# Altium schematic sheet Booster_Main_Board.SchDoc: ='Booster v'+rev
size 420 x 297 mm; Author: G.K.; CompanyName: WUT; DrawnBy: G.K.; Organization: WUT ISE; Address1: Warsaw Univeristy of Technology; Address2: Nowowiejska 15/19; DocumentNumber: 2; SheetNumber: 2; SheetTotal: 6; EDA_Number: ARTIQ; Projet: Booster RF Power Amplifier; ModifiedBy: -; CreateDate: XX/XX/XXXX; CheckedDate: -; Title2: TOP; DivGrp: ISE; Designer: G.K.; ModifiedDate: -; ProjectName: Booster RF Power Amplifier
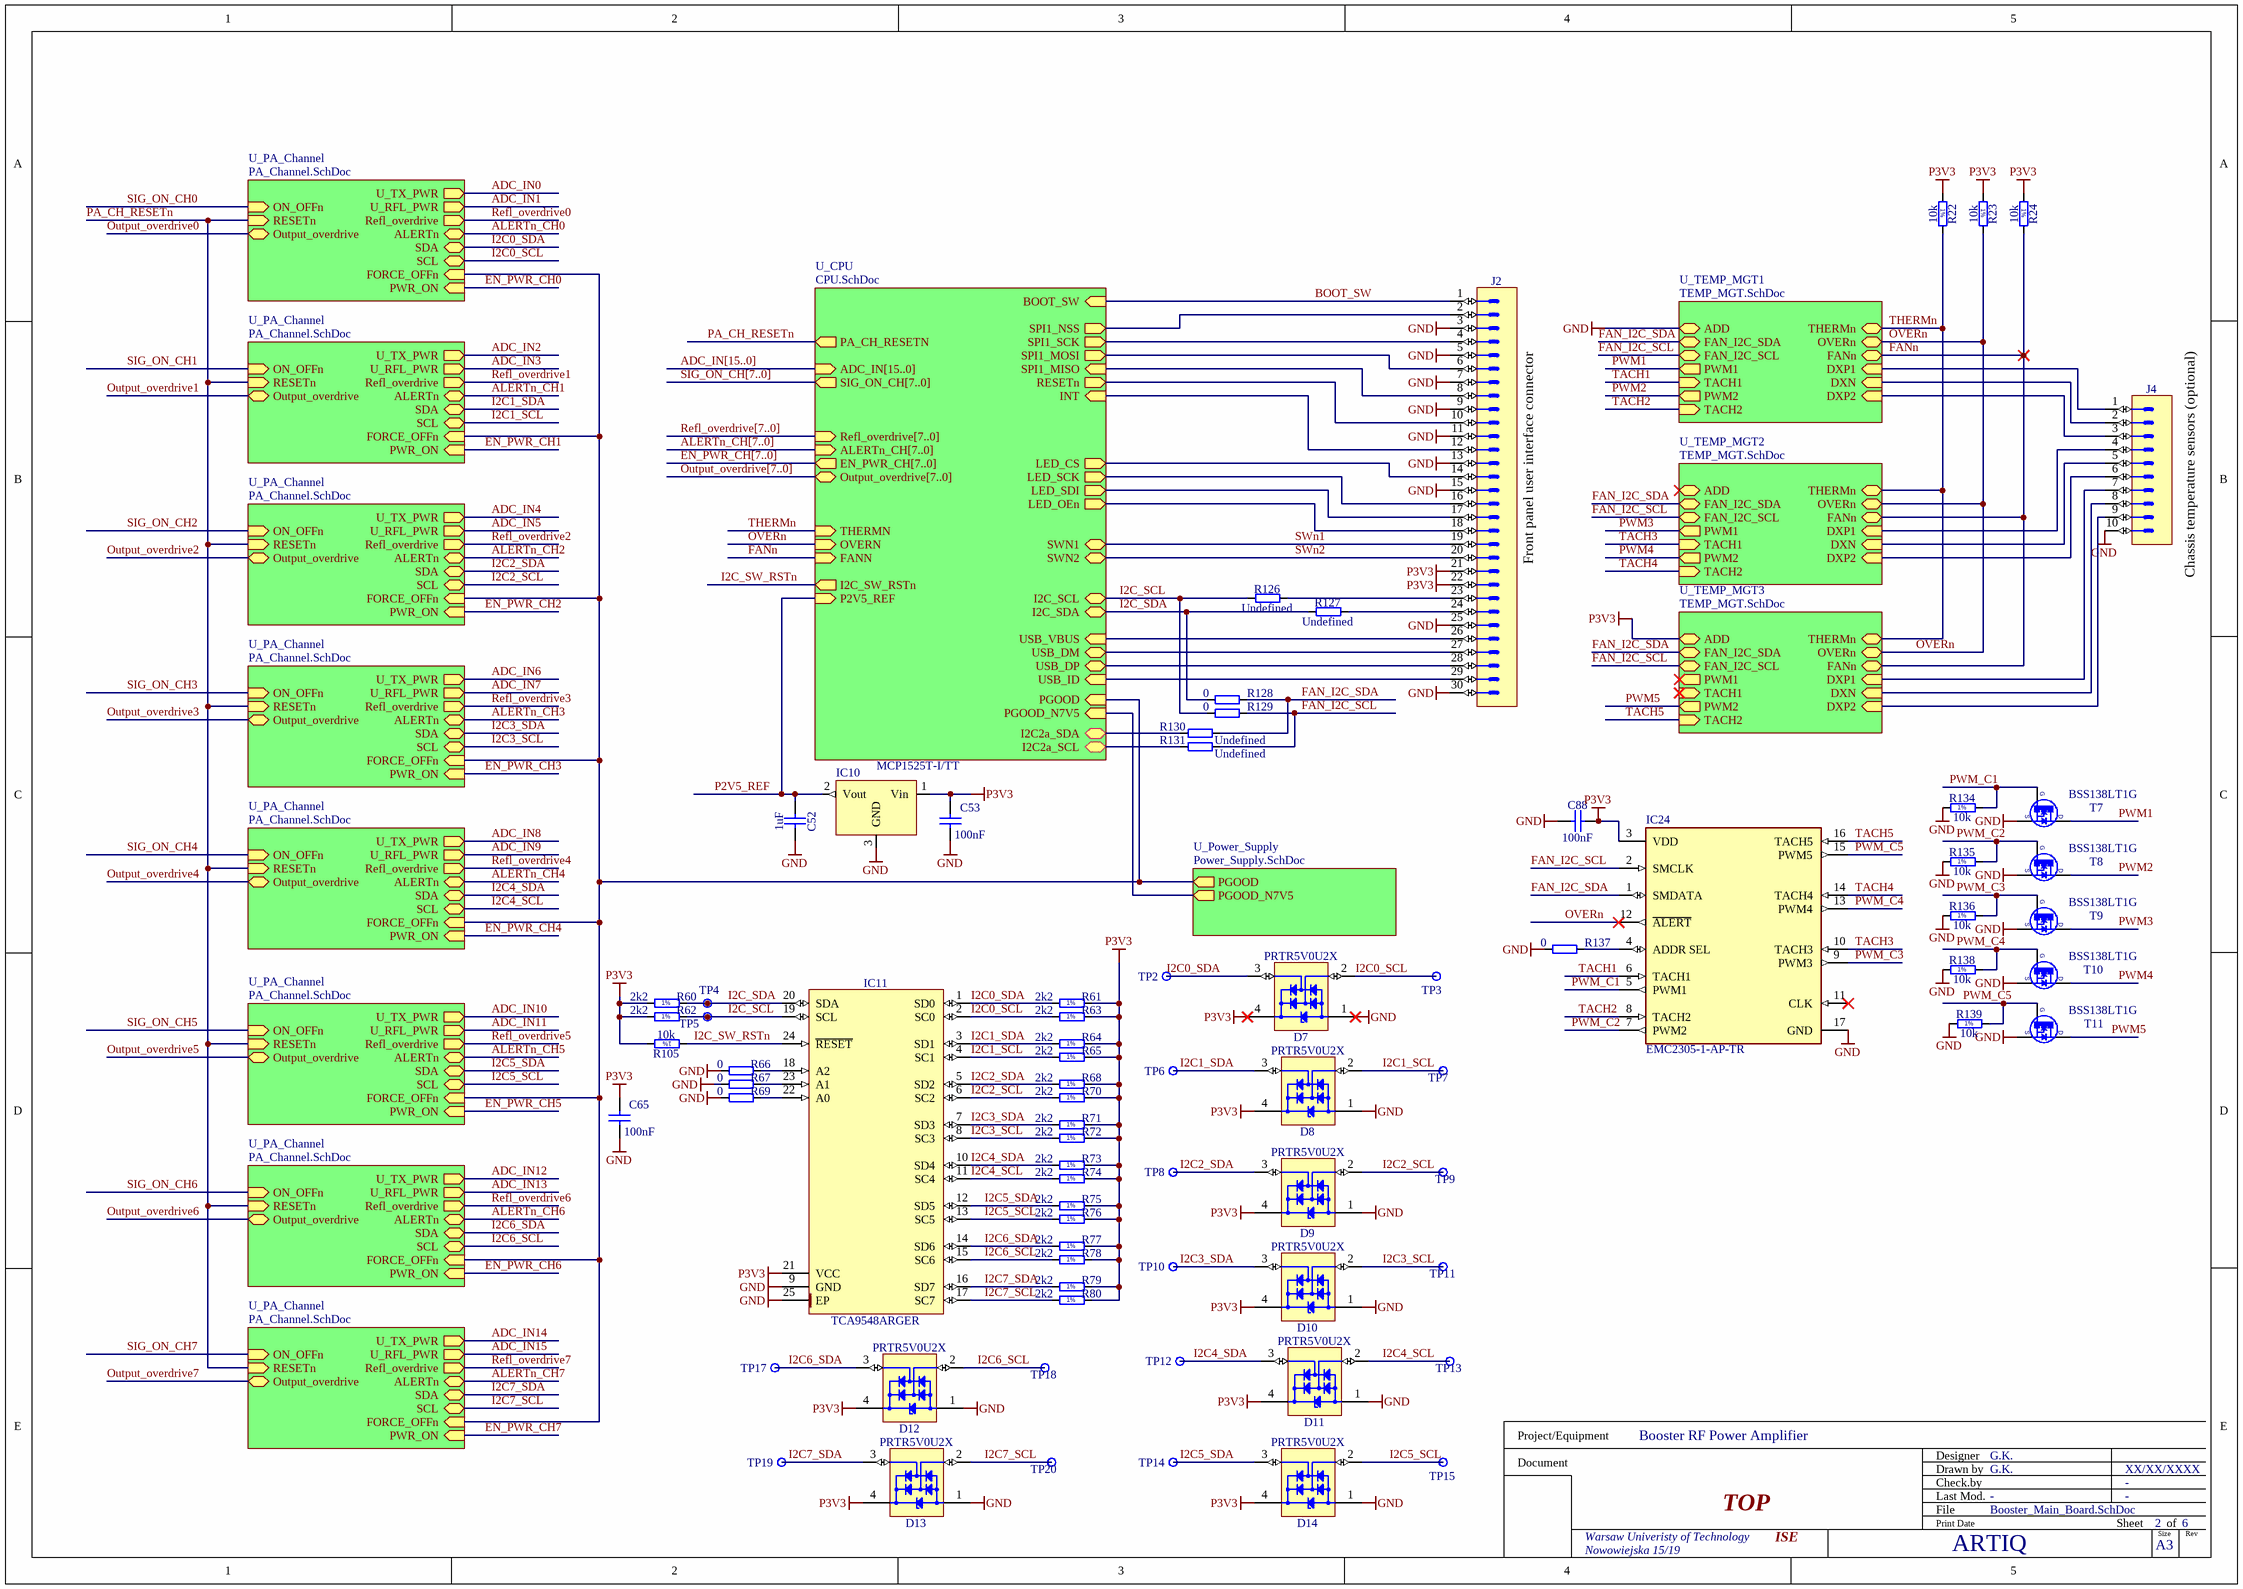
[diagram p0: Booster_Main_Board.SchDoc]

## Parts
C52  1uF  [CAPC1005X55N]
C53  100nF  [CAPC1005X55N]
C65  100nF  [CAPC1005X55N]
C88  100nF  [CAPC1005X55N]
D7  PRTR5V0U2X  [SOT190P230X110-4N]
D8  PRTR5V0U2X  [SOT190P230X110-4N]
D9  PRTR5V0U2X  [SOT190P230X110-4N]
D10  PRTR5V0U2X  [SOT190P230X110-4N]
D11  PRTR5V0U2X  [SOT190P230X110-4N]
D12  PRTR5V0U2X  [SOT190P230X110-4N]
D13  PRTR5V0U2X  [SOT190P230X110-4N]
D14  PRTR5V0U2X  [SOT190P230X110-4N]
IC10  MCP1525T-I/TT  [SOT95P251X112-3N]
IC11  TCA9548ARGER  [QFN50P400X400X100-25N-S220]
IC24  EMC2305-1-AP-TR  [FP-EMC2305-1-AP-TR-MFG]
J2  (no value)  [3M_N2530-6002RB]
J4  Header 10  [3M_N2510-6003RB]  (value not drawn)
R22  10k  [RESC1005X40N]
R23  10k  [RESC1005X40N]
R24  10k  [RESC1005X40N]
R60  2k2  [RESC1005X40N]
R61  2k2  [RESC1005X40N]
R62  2k2  [RESC1005X40N]
R63  2k2  [RESC1005X40N]
R64  2k2  [RESC1005X40N]
R65  2k2  [RESC1005X40N]
R66  0  [RESC1005X40N]
R67  0  [RESC1005X40N]
R68  2k2  [RESC1005X40N]
R69  0  [RESC1005X40N]
R70  2k2  [RESC1005X40N]
R71  2k2  [RESC1005X40N]
R72  2k2  [RESC1005X40N]
R73  2k2  [RESC1005X40N]
R74  2k2  [RESC1005X40N]
R75  2k2  [RESC1005X40N]
R76  2k2  [RESC1005X40N]
R77  2k2  [RESC1005X40N]
R78  2k2  [RESC1005X40N]
R79  2k2  [RESC1005X40N]
R80  2k2  [RESC1005X40N]
R105  10k  [RESC1005X40N]
R126  Undefined  [RESC1005X40N]
R127  Undefined  [RESC1005X40N]
R128  0  [RESC1005X40N]
R129  0  [RESC1005X40N]
R130  Undefined  [RESC1005X40N]
R131  Undefined  [RESC1005X40N]
R134  10k  [RESC1005X40N]
R135  10k  [RESC1005X40N]
R136  10k  [RESC1005X40N]
R137  0  [RESC1005X40N]
R138  10k  [RESC1005X40N]
R139  10k  [RESC1005X40N]
T7  BSS138LT1G  [SOT95P240X110-3N]
T8  BSS138LT1G  [SOT95P240X110-3N]
T9  BSS138LT1G  [SOT95P240X110-3N]
T10  BSS138LT1G  [SOT95P240X110-3N]
T11  BSS138LT1G  [SOT95P240X110-3N]
TP2  Test Point  [TPS127]  (value not drawn)
TP3  Test Point  [TPS127]  (value not drawn)
TP4  Test Point  [TPS127]  (value not drawn)
TP5  Test Point  [TPS127]  (value not drawn)
TP6  Test Point  [TPS127]  (value not drawn)
TP7  Test Point  [TPS127]  (value not drawn)
TP8  Test Point  [TPS127]  (value not drawn)
TP9  Test Point  [TPS127]  (value not drawn)
TP10  Test Point  [TPS127]  (value not drawn)
TP11  Test Point  [TPS127]  (value not drawn)
TP12  Test Point  [TPS127]  (value not drawn)
TP13  Test Point  [TPS127]  (value not drawn)
TP14  Test Point  [TPS127]  (value not drawn)
TP15  Test Point  [TPS127]  (value not drawn)
TP17  Test Point  [TPS127]  (value not drawn)
TP18  Test Point  [TPS127]  (value not drawn)
TP19  Test Point  [TPS127]  (value not drawn)
TP20  Test Point  [TPS127]  (value not drawn)

## Sub-sheets
U_CPU = CPU.SchDoc: ADC_IN[15..0] (in), SIG_ON_CH[7..0] (out), Refl_overdrive[7..0] (in), ALERTn_CH[7..0] (in), SPI1_NSS (out), SPI1_SCK (out), SPI1_MOSI (out), SPI1_MISO (in), RESETn (out), INT (in), LED_CS (out), LED_SCK (out), LED_SDI (out), LED_OEn (out), I2C_SCL (bidir), I2C_SDA (bidir), P2V5_REF (in), USB_DP (bidir), USB_ID (in), USB_DM (bidir), USB_VBUS (in), PA_CH_RESETN (out), PGOOD (in), EN_PWR_CH[7..0] (out), SWN1 (bidir), SWN2 (bidir), Output_overdrive[7..0] (bidir), THERMN (in), OVERN (in), FANN (in), PGOOD_N7V5 (in), BOOT_SW (in), I2C_SW_RSTn (out), I2C2a_SDA (bidir), I2C2a_SCL (bidir)
U_PA_Channel = PA_Channel.SchDoc: U_TX_PWR (out), U_RFL_PWR (out), SDA (bidir), SCL (bidir), ON_OFFn (in), Refl_overdrive (out), ALERTn (bidir), RESETn (in), PWR_ON (in), FORCE_OFFn (in), Output_overdrive (bidir)
U_PA_Channel = PA_Channel.SchDoc: U_TX_PWR (out), U_RFL_PWR (out), SDA (bidir), SCL (bidir), ON_OFFn (in), Refl_overdrive (out), ALERTn (bidir), RESETn (in), PWR_ON (in), FORCE_OFFn (in), Output_overdrive (bidir)
U_PA_Channel = PA_Channel.SchDoc: U_TX_PWR (out), U_RFL_PWR (out), SDA (bidir), SCL (bidir), ON_OFFn (in), Refl_overdrive (out), ALERTn (bidir), RESETn (in), PWR_ON (in), FORCE_OFFn (in), Output_overdrive (bidir)
U_PA_Channel = PA_Channel.SchDoc: U_TX_PWR (out), U_RFL_PWR (out), SDA (bidir), SCL (bidir), ON_OFFn (in), Refl_overdrive (out), ALERTn (bidir), RESETn (in), PWR_ON (in), FORCE_OFFn (in), Output_overdrive (bidir)
U_PA_Channel = PA_Channel.SchDoc: U_TX_PWR (out), U_RFL_PWR (out), SDA (bidir), SCL (bidir), ON_OFFn (in), Refl_overdrive (out), ALERTn (bidir), RESETn (in), PWR_ON (in), FORCE_OFFn (in), Output_overdrive (bidir)
U_PA_Channel = PA_Channel.SchDoc: U_TX_PWR (out), U_RFL_PWR (out), SDA (bidir), SCL (bidir), ON_OFFn (in), Refl_overdrive (out), ALERTn (bidir), RESETn (in), PWR_ON (in), FORCE_OFFn (in), Output_overdrive (bidir)
U_PA_Channel = PA_Channel.SchDoc: U_TX_PWR (out), U_RFL_PWR (out), SDA (bidir), SCL (bidir), ON_OFFn (in), Refl_overdrive (out), ALERTn (bidir), RESETn (in), PWR_ON (in), FORCE_OFFn (in), Output_overdrive (bidir)
U_PA_Channel = PA_Channel.SchDoc: U_TX_PWR (out), U_RFL_PWR (out), SDA (bidir), SCL (bidir), ON_OFFn (in), Refl_overdrive (out), ALERTn (bidir), RESETn (in), PWR_ON (in), FORCE_OFFn (in), Output_overdrive (bidir)
U_Power_Supply = Power_Supply.SchDoc: PGOOD (out), PGOOD_N7V5 (out)
U_TEMP_MGT1 = TEMP_MGT.SchDoc: ADD (bidir), THERMn (bidir), OVERn (bidir), FANn (bidir), FAN_I2C_SCL (bidir), FAN_I2C_SDA (bidir), DXP1 (in), DXN (in), DXP2 (in), PWM2 (out), TACH2 (in), TACH1 (in), PWM1 (out)
U_TEMP_MGT2 = TEMP_MGT.SchDoc: ADD (bidir), THERMn (bidir), OVERn (bidir), FANn (bidir), FAN_I2C_SCL (bidir), FAN_I2C_SDA (bidir), DXP1 (in), DXN (in), DXP2 (in), PWM2 (out), TACH2 (in), TACH1 (in), PWM1 (out)
U_TEMP_MGT3 = TEMP_MGT.SchDoc: ADD (bidir), THERMn (bidir), OVERn (bidir), FANn (bidir), FAN_I2C_SCL (bidir), FAN_I2C_SDA (bidir), DXP1 (in), DXN (in), DXP2 (in), PWM2 (out), TACH2 (in), TACH1 (in), PWM1 (out)

## Nets
GND: C52.2 C53.2 C65.2 C88.1 D7.1(GND) D8.1(GND) D9.1(GND) D10.1(GND) D11.1(GND) D12.1(GND) D13.1(GND) D14.1(GND) IC10.3(GND) IC11.9(GND) IC11.25(EP) IC24.17(GND) J2.3 J2.5 J2.7 J2.9 J2.11 J2.13 J2.15 J2.25 J2.30 J4.10 R66.1 R67.1 R69.1 R134.1 R135.1 R136.1 R137.1 R138.1 R139.1 T7.2(S) T8.2(S) T9.2(S) T10.2(S) T11.2(S) ; sheet U_TEMP_MGT1/ADD
P3V3: C53.1 C65.1 C88.2 D7.4(VCC) D8.4(VCC) D9.4(VCC) D10.4(VCC) D11.4(VCC) D12.4(VCC) D13.4(VCC) D14.4(VCC) IC10.1(Vin) IC11.21(VCC) IC24.3(VDD) J2.21 J2.22 R22.1 R23.1 R24.1 R60.1 R61.2 R62.1 R63.2 R64.2 R65.2 R68.2 R70.2 R71.2 R72.2 R73.2 R74.2 R75.2 R76.2 R77.2 R78.2 R79.2 R80.2 R105.2 ; sheet U_TEMP_MGT3/ADD
ADC_IN0: sheet U_PA_Channel/U_TX_PWR
ADC_IN1: sheet U_PA_Channel/U_RFL_PWR
ADC_IN2: sheet U_PA_Channel/U_TX_PWR
ADC_IN3: sheet U_PA_Channel/U_RFL_PWR
ADC_IN4: sheet U_PA_Channel/U_TX_PWR
ADC_IN5: sheet U_PA_Channel/U_RFL_PWR
ADC_IN6: sheet U_PA_Channel/U_TX_PWR
ADC_IN7: sheet U_PA_Channel/U_RFL_PWR
ADC_IN8: sheet U_PA_Channel/U_TX_PWR
ADC_IN9: sheet U_PA_Channel/U_RFL_PWR
ADC_IN10: sheet U_PA_Channel/U_TX_PWR
ADC_IN11: sheet U_PA_Channel/U_RFL_PWR
ADC_IN12: sheet U_PA_Channel/U_TX_PWR
ADC_IN13: sheet U_PA_Channel/U_RFL_PWR
ADC_IN14: sheet U_PA_Channel/U_TX_PWR
ADC_IN15: sheet U_PA_Channel/U_RFL_PWR
ALERTn_CH0: sheet U_PA_Channel/ALERTn
ALERTn_CH1: sheet U_PA_Channel/ALERTn
ALERTn_CH2: sheet U_PA_Channel/ALERTn
ALERTn_CH3: sheet U_PA_Channel/ALERTn
ALERTn_CH4: sheet U_PA_Channel/ALERTn
ALERTn_CH5: sheet U_PA_Channel/ALERTn
ALERTn_CH6: sheet U_PA_Channel/ALERTn
ALERTn_CH7: sheet U_PA_Channel/ALERTn
BOOT_SW: J2.1 ; sheet U_CPU/BOOT_SW
EN_PWR_CH0: sheet U_PA_Channel/PWR_ON
EN_PWR_CH1: sheet U_PA_Channel/PWR_ON
EN_PWR_CH2: sheet U_PA_Channel/PWR_ON
EN_PWR_CH3: sheet U_PA_Channel/PWR_ON
EN_PWR_CH4: sheet U_PA_Channel/PWR_ON
EN_PWR_CH5: sheet U_PA_Channel/PWR_ON
EN_PWR_CH6: sheet U_PA_Channel/PWR_ON
EN_PWR_CH7: sheet U_PA_Channel/PWR_ON
FAN_I2C_SCL: IC24.2(SMCLK) R129.2 R131.2 ; sheet U_TEMP_MGT1/FAN_I2C_SCL, sheet U_TEMP_MGT2/FAN_I2C_SCL, sheet U_TEMP_MGT3/FAN_I2C_SCL
FAN_I2C_SDA: IC24.1(SMDATA) R128.2 R130.2 ; sheet U_TEMP_MGT1/FAN_I2C_SDA, sheet U_TEMP_MGT2/FAN_I2C_SDA, sheet U_TEMP_MGT3/FAN_I2C_SDA
FANn: R24.2 ; sheet U_CPU/FANN, sheet U_TEMP_MGT1/FANn, sheet U_TEMP_MGT2/FANn, sheet U_TEMP_MGT3/FANn
I2C0_SCL: D7.2(I/O1) IC11.2(SC0) R63.1 TP3.1 ; sheet U_PA_Channel/SCL
I2C0_SDA: D7.3(I/O2) IC11.1(SD0) R61.1 TP2.1 ; sheet U_PA_Channel/SDA
I2C1_SCL: D8.2(I/O1) IC11.4(SC1) R65.1 TP7.1 ; sheet U_PA_Channel/SCL
I2C1_SDA: D8.3(I/O2) IC11.3(SD1) R64.1 TP6.1 ; sheet U_PA_Channel/SDA
I2C2_SCL: D9.2(I/O1) IC11.6(SC2) R70.1 TP9.1 ; sheet U_PA_Channel/SCL
I2C2_SDA: D9.3(I/O2) IC11.5(SD2) R68.1 TP8.1 ; sheet U_PA_Channel/SDA
I2C3_SCL: D10.2(I/O1) IC11.8(SC3) R72.1 TP11.1 ; sheet U_PA_Channel/SCL
I2C3_SDA: D10.3(I/O2) IC11.7(SD3) R71.1 TP10.1 ; sheet U_PA_Channel/SDA
I2C4_SCL: D11.2(I/O1) IC11.11(SC4) R74.1 TP13.1 ; sheet U_PA_Channel/SCL
I2C4_SDA: D11.3(I/O2) IC11.10(SD4) R73.1 TP12.1 ; sheet U_PA_Channel/SDA
I2C5_SCL: D14.2(I/O1) IC11.13(SC5) R76.1 TP15.1 ; sheet U_PA_Channel/SCL
I2C5_SDA: D14.3(I/O2) IC11.12(SD5) R75.1 TP14.1 ; sheet U_PA_Channel/SDA
I2C6_SCL: D12.2(I/O1) IC11.15(SC6) R78.1 TP18.1 ; sheet U_PA_Channel/SCL
I2C6_SDA: D12.3(I/O2) IC11.14(SD6) R77.1 TP17.1 ; sheet U_PA_Channel/SDA
I2C7_SCL: D13.2(I/O1) IC11.17(SC7) R80.1 TP20.1 ; sheet U_PA_Channel/SCL
I2C7_SDA: D13.3(I/O2) IC11.16(SD7) R79.1 TP19.1 ; sheet U_PA_Channel/SDA
I2C_SCL: IC11.19(SCL) R62.2 R126.1 R129.1 TP5.1 ; sheet U_CPU/I2C_SCL
I2C_SDA: IC11.20(SDA) R60.2 R127.1 R128.1 TP4.1 ; sheet U_CPU/I2C_SDA
I2C_SW_RSTn: IC11.24(~{RESET}) R105.1 ; sheet U_CPU/I2C_SW_RSTn
Output_overdrive0: sheet U_PA_Channel/Output_overdrive
Output_overdrive1: sheet U_PA_Channel/Output_overdrive
Output_overdrive2: sheet U_PA_Channel/Output_overdrive
Output_overdrive3: sheet U_PA_Channel/Output_overdrive
Output_overdrive4: sheet U_PA_Channel/Output_overdrive
Output_overdrive5: sheet U_PA_Channel/Output_overdrive
Output_overdrive6: sheet U_PA_Channel/Output_overdrive
Output_overdrive7: sheet U_PA_Channel/Output_overdrive
OVERn: IC24.12(~{ALERT}) R23.2 ; sheet U_CPU/OVERN, sheet U_TEMP_MGT1/OVERn, sheet U_TEMP_MGT2/OVERn, sheet U_TEMP_MGT3/OVERn
P2V5_REF: C52.1 IC10.2(Vout) ; sheet U_CPU/P2V5_REF
PA_CH_RESETn: sheet U_CPU/PA_CH_RESETN, sheet U_PA_Channel/RESETn, sheet U_PA_Channel/RESETn, sheet U_PA_Channel/RESETn, sheet U_PA_Channel/RESETn, sheet U_PA_Channel/RESETn, sheet U_PA_Channel/RESETn, sheet U_PA_Channel/RESETn, sheet U_PA_Channel/RESETn
PWM1: T7.3(D) ; sheet U_TEMP_MGT1/PWM1
PWM2: T8.3(D) ; sheet U_TEMP_MGT1/PWM2
PWM3: T9.3(D) ; sheet U_TEMP_MGT2/PWM1
PWM4: T10.3(D) ; sheet U_TEMP_MGT2/PWM2
PWM5: T11.3(D) ; sheet U_TEMP_MGT3/PWM2
PWM_C1: IC24.5(PWM1) R134.2 T7.1(G)
PWM_C2: IC24.7(PWM2) R135.2 T8.1(G)
PWM_C3: IC24.9(PWM3) R136.2 T9.1(G)
PWM_C4: IC24.13(PWM4) R138.2 T10.1(G)
PWM_C5: IC24.15(PWM5) R139.2 T11.1(G)
Refl_overdrive0: sheet U_PA_Channel/Refl_overdrive
Refl_overdrive1: sheet U_PA_Channel/Refl_overdrive
Refl_overdrive2: sheet U_PA_Channel/Refl_overdrive
Refl_overdrive3: sheet U_PA_Channel/Refl_overdrive
Refl_overdrive4: sheet U_PA_Channel/Refl_overdrive
Refl_overdrive5: sheet U_PA_Channel/Refl_overdrive
Refl_overdrive6: sheet U_PA_Channel/Refl_overdrive
Refl_overdrive7: sheet U_PA_Channel/Refl_overdrive
SIG_ON_CH0: sheet U_PA_Channel/ON_OFFn
SIG_ON_CH1: sheet U_PA_Channel/ON_OFFn
SIG_ON_CH2: sheet U_PA_Channel/ON_OFFn
SIG_ON_CH3: sheet U_PA_Channel/ON_OFFn
SIG_ON_CH4: sheet U_PA_Channel/ON_OFFn
SIG_ON_CH5: sheet U_PA_Channel/ON_OFFn
SIG_ON_CH6: sheet U_PA_Channel/ON_OFFn
SIG_ON_CH7: sheet U_PA_Channel/ON_OFFn
SWn1: J2.19 ; sheet U_CPU/SWN1
SWn2: J2.20 ; sheet U_CPU/SWN2
TACH1: IC24.6(TACH1) ; sheet U_TEMP_MGT1/TACH1
TACH2: IC24.8(TACH2) ; sheet U_TEMP_MGT1/TACH2
TACH3: IC24.10(TACH3) ; sheet U_TEMP_MGT2/TACH1
TACH4: IC24.14(TACH4) ; sheet U_TEMP_MGT2/TACH2
TACH5: IC24.16(TACH5) ; sheet U_TEMP_MGT3/TACH2
THERMn: R22.2 ; sheet U_CPU/THERMN, sheet U_TEMP_MGT1/THERMn, sheet U_TEMP_MGT2/THERMn, sheet U_TEMP_MGT3/THERMn
NetIC11_18: IC11.18(A2) R66.2
NetIC11_22: IC11.22(A0) R69.2
NetIC11_23: IC11.23(A1) R67.2
NetIC24_4: IC24.4(ADDR_SEL) R137.2
NetJ2_2: J2.2 ; sheet U_CPU/SPI1_NSS
NetJ2_4: J2.4 ; sheet U_CPU/SPI1_SCK
NetJ2_6: J2.6 ; sheet U_CPU/SPI1_MOSI
NetJ2_8: J2.8 ; sheet U_CPU/SPI1_MISO
NetJ2_10: J2.10 ; sheet U_CPU/RESETn
NetJ2_12: J2.12 ; sheet U_CPU/INT
NetJ2_14: J2.14 ; sheet U_CPU/LED_CS
NetJ2_16: J2.16 ; sheet U_CPU/LED_SCK
NetJ2_17: J2.17 ; sheet U_CPU/LED_SDI
NetJ2_18: J2.18 ; sheet U_CPU/LED_OEn
NetJ2_23: J2.23 R126.2
NetJ2_24: J2.24 R127.2
NetJ2_26: J2.26 ; sheet U_CPU/USB_VBUS
NetJ2_27: J2.27 ; sheet U_CPU/USB_DM
NetJ2_28: J2.28 ; sheet U_CPU/USB_DP
NetJ2_29: J2.29 ; sheet U_CPU/USB_ID
NetJ4_1: J4.1 ; sheet U_TEMP_MGT1/DXP1
NetJ4_2: J4.2 ; sheet U_TEMP_MGT1/DXN
NetJ4_3: J4.3 ; sheet U_TEMP_MGT1/DXP2
NetJ4_4: J4.4 ; sheet U_TEMP_MGT2/DXP1
NetJ4_5: J4.5 ; sheet U_TEMP_MGT2/DXN
NetJ4_6: J4.6 ; sheet U_TEMP_MGT2/DXP2
NetJ4_7: J4.7 ; sheet U_TEMP_MGT3/DXP1
NetJ4_8: J4.8 ; sheet U_TEMP_MGT3/DXN
NetJ4_9: J4.9 ; sheet U_TEMP_MGT3/DXP2
NetR130_1: R130.1 ; sheet U_CPU/I2C2a_SDA
NetR131_1: R131.1 ; sheet U_CPU/I2C2a_SCL
(unnamed): sheet U_CPU/PGOOD, sheet U_PA_Channel/FORCE_OFFn, sheet U_PA_Channel/FORCE_OFFn, sheet U_PA_Channel/FORCE_OFFn, sheet U_PA_Channel/FORCE_OFFn, sheet U_PA_Channel/FORCE_OFFn, sheet U_PA_Channel/FORCE_OFFn, sheet U_PA_Channel/FORCE_OFFn, sheet U_PA_Channel/FORCE_OFFn, sheet U_Power_Supply/PGOOD
(unnamed): sheet U_CPU/PGOOD_N7V5, sheet U_Power_Supply/PGOOD_N7V5

Not connected (* = marked no-connect by the designer): IC24 11(CLK)*

## Buses and harness runs
bus ADC_IN[15..0] = sheet U_CPU/ADC_IN[15..0]
bus ALERTn_CH[7..0] = sheet U_CPU/ALERTn_CH[7..0]
bus EN_PWR_CH[7..0] = sheet U_CPU/EN_PWR_CH[7..0]
bus Output_overdrive[7..0] = sheet U_CPU/Output_overdrive[7..0]
bus Refl_overdrive[7..0] = sheet U_CPU/Refl_overdrive[7..0]
bus SIG_ON_CH[7..0] = sheet U_CPU/SIG_ON_CH[7..0]

## Notes on the sheet
- (near J2) Front panel user interface connector
- (near J4) Chassis temperature sensors (optional)
- Project/Equipment
- Document
- Designer
- Drawn by
- Check.by
- File
- Last Mod.
- Print Date
- Sheet
- Size
- A3
- of
- Rev
- (in symbol R0402_2K2_1%_0.0625W_100PPM) 1%
- (in symbol R0402_10K_1%_0.0625W_100PPM) 1%

## Library data of the parts
C52 = CC0402_1UF_16V_10%_X5R: Non-polarised capacitor; Part Description: SMD Multilayer Chip Ceramic Capacitor; Manufacturer: GENERIC; Manufacturer1 Part Number: C1005X5R1C105KT; Voltage: 16V; TC: X5R; Tolerance: ±10%; Part Number: CC0402_1UF_16V_10%_X5R; Component Kind: Standard; Component Type: Standard; Pin Count: 2; Value: 1uF; Status: Preferred; Manufacturer Part Number: CC0402_1UF_16V_10%_X5R; Case: 0402; Mounted: Yes; Socket: No; SMD: Yes; Manufacturer1 Example: TDK; Manufacturer1 ComponentHeight: 0.55mm; HelpURL: \\cern.ch\dfs\Applications\Altium\Datasheets\CC0402_X5R_TDK_C.pdf; Author: CERN DEM JLC; CreateDate: 25.10.2012; LatestRevisionDate: 25.10.2012; Sense: No
C53 C65 = CC0402_100NF_16V_10%_X7R: Non-polarised capacitor; Part Description: SMD Multilayer Chip Ceramic Capacitor; Manufacturer: GENERIC; Manufacturer1 Part Number: GRM155R71C104KA88D; Voltage: 16V; TC: X7R; Tolerance: ±10%; Table: Capacitors SMD; Part Number: CC0402_100NF_16V_10%_X7R; Component Kind: Standard; Component Type: Standard; Pin Count: 2; Value: 100nF; Status: Not Recommended; Manufacturer Part Number: CC0402_100NF_16V_10%_X7R; Case: 0402; Mounted: Yes; Socket: No; SMD: Yes; Manufacturer1 Example: MURATA; Manufacturer1 ComponentHeight: 0.55mm; HelpURL: \\cern.ch\dfs\Applications\Altium\Datasheets\CC0402_X7R_MURATA_GRM.pdf; Author: CERN DEM JLC; CreateDate: 2013-12-05; LatestRevisionDate: 2007-12-03
C88 = CC0402_100NF_16V_10%_X7R: Non-polarised capacitor; Part Description: SMD Multilayer Chip Ceramic Capacitor; Manufacturer: GENERIC; Manufacturer1 Part Number: GRM155R71C104KA88D; Voltage: 16V; TC: X7R; Tolerance: ±10%; Part Number: CC0402_100NF_16V_10%_X7R; Component Kind: Standard; Component Type: Standard; Pin Count: 2; Value: 100nF; Status: Not Recommended; Manufacturer Part Number: CC0402_100NF_16V_10%_X7R; Case: 0402; Mounted: Yes; Socket: No; SMD: Yes; Manufacturer1 Example: MURATA; Manufacturer1 ComponentHeight: 0.55mm; HelpURL: \\cern.ch\dfs\Applications\Altium\Datasheets\CC0402_X7R_MURATA_GRM.pdf; Author: CERN DEM JLC; CreateDate: 05.12.2013; LatestRevisionDate: 03.12.2007; Sense: No
D7-D14 = PRTR5V0U2X: Ultra Low Capacitance Double Rail-to-Rail ESD Protection Diode; Part Description: Ultra Low Capacitance (1pF) Double Rail-to-Rail ESD Protection Diode (8kV); Manufacturer: NXP SEMICONDUCTORS; Voltage: 5.5V; PressFit: No; Bonding: No; Part Number: PRTR5V0U2X; Component Kind: Standard; Component Type: Standard; Device: PRTR5V0U2X; PackageDescription: SOT143B, SOT, 1.90mm Pitch; 4 Pin, 1.30mm W X 2.90mm L X 1.10mm H body, IPC Medium Density; Manufacturer Part Number: PRTR5V0U2X; Pin Count: 4; Case: SOT143B; Mounted: Yes; Socket: No; SMD: Yes; Sense: No; ComponentHeight: 1.1mm; HelpURL: \\cern.ch\dfs\Applications\Altium\Datasheets\PRTR5V0U2X.pdf; Author: CERN DEM JLC; CreateDate: 22.03.2011; LatestRevisionDate: 22.03.2011
IC10 = REF_MCP1525: 2.5 voltage reference; Manufacturer Part Number: MCP1525T-I/TT
IC11 = TCA9548ARGER: Low Voltage 8-Channel I2C Switch With Reset; Manufacturer: TEXAS INSTRUMENTS; PressFit: No; Bonding: No; Part Number: TCA9548ARGER; Component Kind: Standard; Component Type: Standard; Device: TCA9548ARGER; PackageDescription: QFN, 0.50mm Pitch, Square; 24 Pin, 4.00mm L X 4.00mm W X 1.00mm H body (w/thermal tab 2.2 X 2.2mm), IPC Medium Density; Part Description: Low Voltage 8-Channel I2C Switch With Reset; Manufacturer Part Number: TCA9548ARGER; Pin Count: 25; Case: QFN24; Mounted: Yes; Socket: No; SMD: Yes; Sense: No; ComponentHeight: 1mm; Author: CERN DEM JLC; HelpURL: \\cern.ch\dfs\Applications\Altium\Datasheets\TCA9548ARGER.pdf; CreateDate: 07.07.2014; LatestRevisionDate: 07.07.2014
IC24 = CMP-06317-000016-1: IC MOTOR DRIVER 3V-3.6V 16QFN; Interface: I2C; Max Supply Voltage (DC): 3.6V; Operating Supply Current: 625uA; Operating Supply Voltage: 3.3V; Min Supply Voltage: 3V; Accuracy: 2%; Output Type: Analog; Number of Outputs: 5; Number of Pins: 16; Radiation Hardening: No; Mount: Surface Mount; Series: *; Min Operating Temperature: -40°C; REACH SVHC: No SVHC; Lead Free: Lead Free; Package Quantity: 1; Case/Package: QFN; Packaging: Tape and Reel; Max Supply Voltage: 3.6V; Max Operating Temperature: 125°C; Min Supply Voltage (DC): 3V
J2 = 3M_N2530-6002RB: Connector 30 Male; Part Description: 30 Contacts - Straight .100'' x .100'' Low Profile Four-Wall Header, 2500 Series; Manufacturer: 3M; PressFit: No; Part Number: 3M_N2530-6002RB; Component Kind: Standard; Component Type: Standard; Pin Count: 30; Family: Header 30; Mounted: Yes; Socket: No; SMD: No; Sense: No; Status: None; Manufacturer Part Number: N2530-6002RB; ComponentHeight: 10.03mm; HelpURL: \\cern.ch\dfs\Applications\Altium\Datasheets\3M_N2530-6002RB.pdf; Author: CERN DEM JLC; CreateDate: 11.02.2009; LatestRevisionDate: 11.08.2009
J4 = 3M_N2510-6003RB: Connector 10 Male; Part Description: 10 Contacts - Straight .100'' x .100'' Low Profile Four-Wall Header(Solder Tail 3.94mm), 2500 Series; Manufacturer: 3M; PressFit: No; Part Number: 3M_N2510-6003RB; Component Kind: Standard; Component Type: Standard; Pin Count: 10; Family: Header 10; Mounted: Yes; Socket: No; SMD: No; Sense: No; Status: None; Manufacturer Part Number: N2510-6003RB; ComponentHeight: 10.03mm; HelpURL: \\cern.ch\dfs\Applications\Altium\Datasheets\3M_N2510-6003RB.pdf; Author: CERN DEM JLC; CreateDate: 15.08.2011; LatestRevisionDate: 15.08.2011
R22-R24 R105 R134-R136 R138 R139 = R0402_10K_1%_0.0625W_100PPM: Resistor - 1%; Part Description: General Purpose Thick Film Chip Resistor; Manufacturer: GENERIC; Manufacturer1 Part Number: 232270671003L; TC: ±100ppm/°C; Table: Resistors SMD; Part Number: R0402_10K_1%_0.0625W_100PPM; Component Kind: Standard; Component Type: Standard; Pin Count: 2; Value: 10k; Status: Not recommended; Power: 0.0625W; Tolerance: ±1%; Manufacturer Part Number: R0402_10K_1%_0.0625W_100PPM; Case: 0402; Mounted: Yes; Socket: No; SMD: Yes; Manufacturer1 Example: YAGEO PHYCOMP; Manufacturer1 ComponentHeight: 0.4mm; HelpURL: \\cern.ch\dfs\Applications\Altium\Datasheets\R0402_Phycomp_RC0402.pdf; Author: CERN DEM JLC; CreateDate: 2007-12-03; LatestRevisionDate: 2012-10-17
R60-R65 R68 R70-R80 = R0402_2K2_1%_0.0625W_100PPM: Resistor - 1%; Part Description: General Purpose Thick Film Chip Resistor; Manufacturer: GENERIC; Manufacturer1 Part Number: 232270672202L; TC: ±100ppm/°C; Part Number: R0402_2K2_1%_0.0625W_100PPM; Component Kind: Standard; Component Type: Standard; Pin Count: 2; Value: 2k2; Status: Not recommended; Power: 0.0625W; Tolerance: ±1%; Manufacturer Part Number: R0402_2K2_1%_0.0625W_100PPM; Case: 0402; Mounted: Yes; Sense: No; Socket: No; SMD: Yes; Manufacturer1 Example: YAGEO PHYCOMP; Manufacturer1 ComponentHeight: 0.4mm; HelpURL: \\cern.ch\dfs\Applications\Altium\Datasheets\R0402_Phycomp_RC0402.pdf; Author: CERN DEM JLC; CreateDate: 03.12.2007; LatestRevisionDate: 17.10.2012
R66 R67 R69 R128 R129 R137 = R0402_0R_JUMPER: Resistor; Part Description: 1A (0.05R Max DC Resistance) Zero Ohm Jumper; Manufacturer: GENERIC; Manufacturer1 Part Number: 232270591001L; Part Number: R0402_0R_JUMPER; Component Kind: Standard; Component Type: Standard; Pin Count: 2; Value: 0; Status: Not recommended; Manufacturer Part Number: R0402_0R_JUMPER; Case: 0402; Mounted: Yes; Sense: No; Socket: No; SMD: Yes; Manufacturer1 Example: YAGEO PHYCOMP; Manufacturer1 ComponentHeight: 0.4mm; HelpURL: \\cern.ch\dfs\Applications\Altium\Datasheets\R0402_Phycomp_RC0402.pdf; Author: CERN DEM JLC; CreateDate: 03.12.2007; LatestRevisionDate: 17.10.2012
R126 R127 R130 R131 = R0402_NO-VALUE: Resistor; Part Description: Reserved Footprint For a 0402 (1005) Chip Resistor; PressFit: No; Mounted: No; Part Number: R0402_NO-VALUE; Component Kind: Standard; Component Type: Standard; Pin Count: 2; Value: Undefined; Status: None; Manufacturer: Undefined; Manufacturer Part Number: R0402_NO-VALUE; Case: 0402; Sense: No; Socket: No; SMD: Yes; Manufacturer1 Example: Undefined; Manufacturer1 Part Number: Undefined; Manufacturer1 ComponentHeight: Undefined; HelpURL: Undefined; Author: CERN DEM JLC; CreateDate: 03.12.2007; LatestRevisionDate: 13.03.2008
T7-T11 = BSS138LT1G: N-CHANNEL MOSFET WITH DIODE; Part Description: 50V 200mA N-Channel Enhancement Mode Field-Effect Transistor; Manufacturer: ON SEMICONDUCTOR; PressFit: No; Bonding: No; Table: Transistors; Part Number: BSS138LT1G; Component Kind: Standard; Component Type: Standard; Device: BSS138LT1G; PackageDescription: SOT23 3-Leads, Pitch 0.95mm - Body 1.4x3mm, IPC Medium Density; Manufacturer Part Number: BSS138LT1G; Pin Count: 3; Case: SOT23-3; Mounted: Yes; Socket: No; SMD: Yes; ComponentHeight: 1.11mm; HelpURL: \\cern.ch\dfs\Applications\Altium\Datasheets\BSS138LT1G.pdf; Author: CERN DEM JLC; CreateDate: 2009-03-23; LatestRevisionDate: 2009-03-23
TP2-TP15 TP17-TP20 = SMD_PAD_1.27X1.27MM: Part Description: 1.27mm x 1.27mm PCB Copper Area (SMD Test Point); Mounted: No; Part Number: SMD_PAD_1.27X1.27MM; Component Kind: Standard (No BOM); Component Type: Standard (No BOM); Pin Count: 1; Family: Test Point; Socket: No; SMD: Yes; Sense: No; Status: None; ComponentHeight: 0mm; HelpURL: Undefined; Author: CERN DEM JLC; CreateDate: 12/01/2008; LatestRevisionDate: 12/01/2008; PackageDescription: 1.27mm x 1.27mm PCB Copper Area (SMD Test Point)